# EAGLE design Own_21700_Board_Plus.pro_v1.1_Final_AR (EAGLE 9.6.2)
COMPANY: ADAFRUIT INDUSTRIES; DRAWN: KTOWN; REV: A; YEAR: 2019
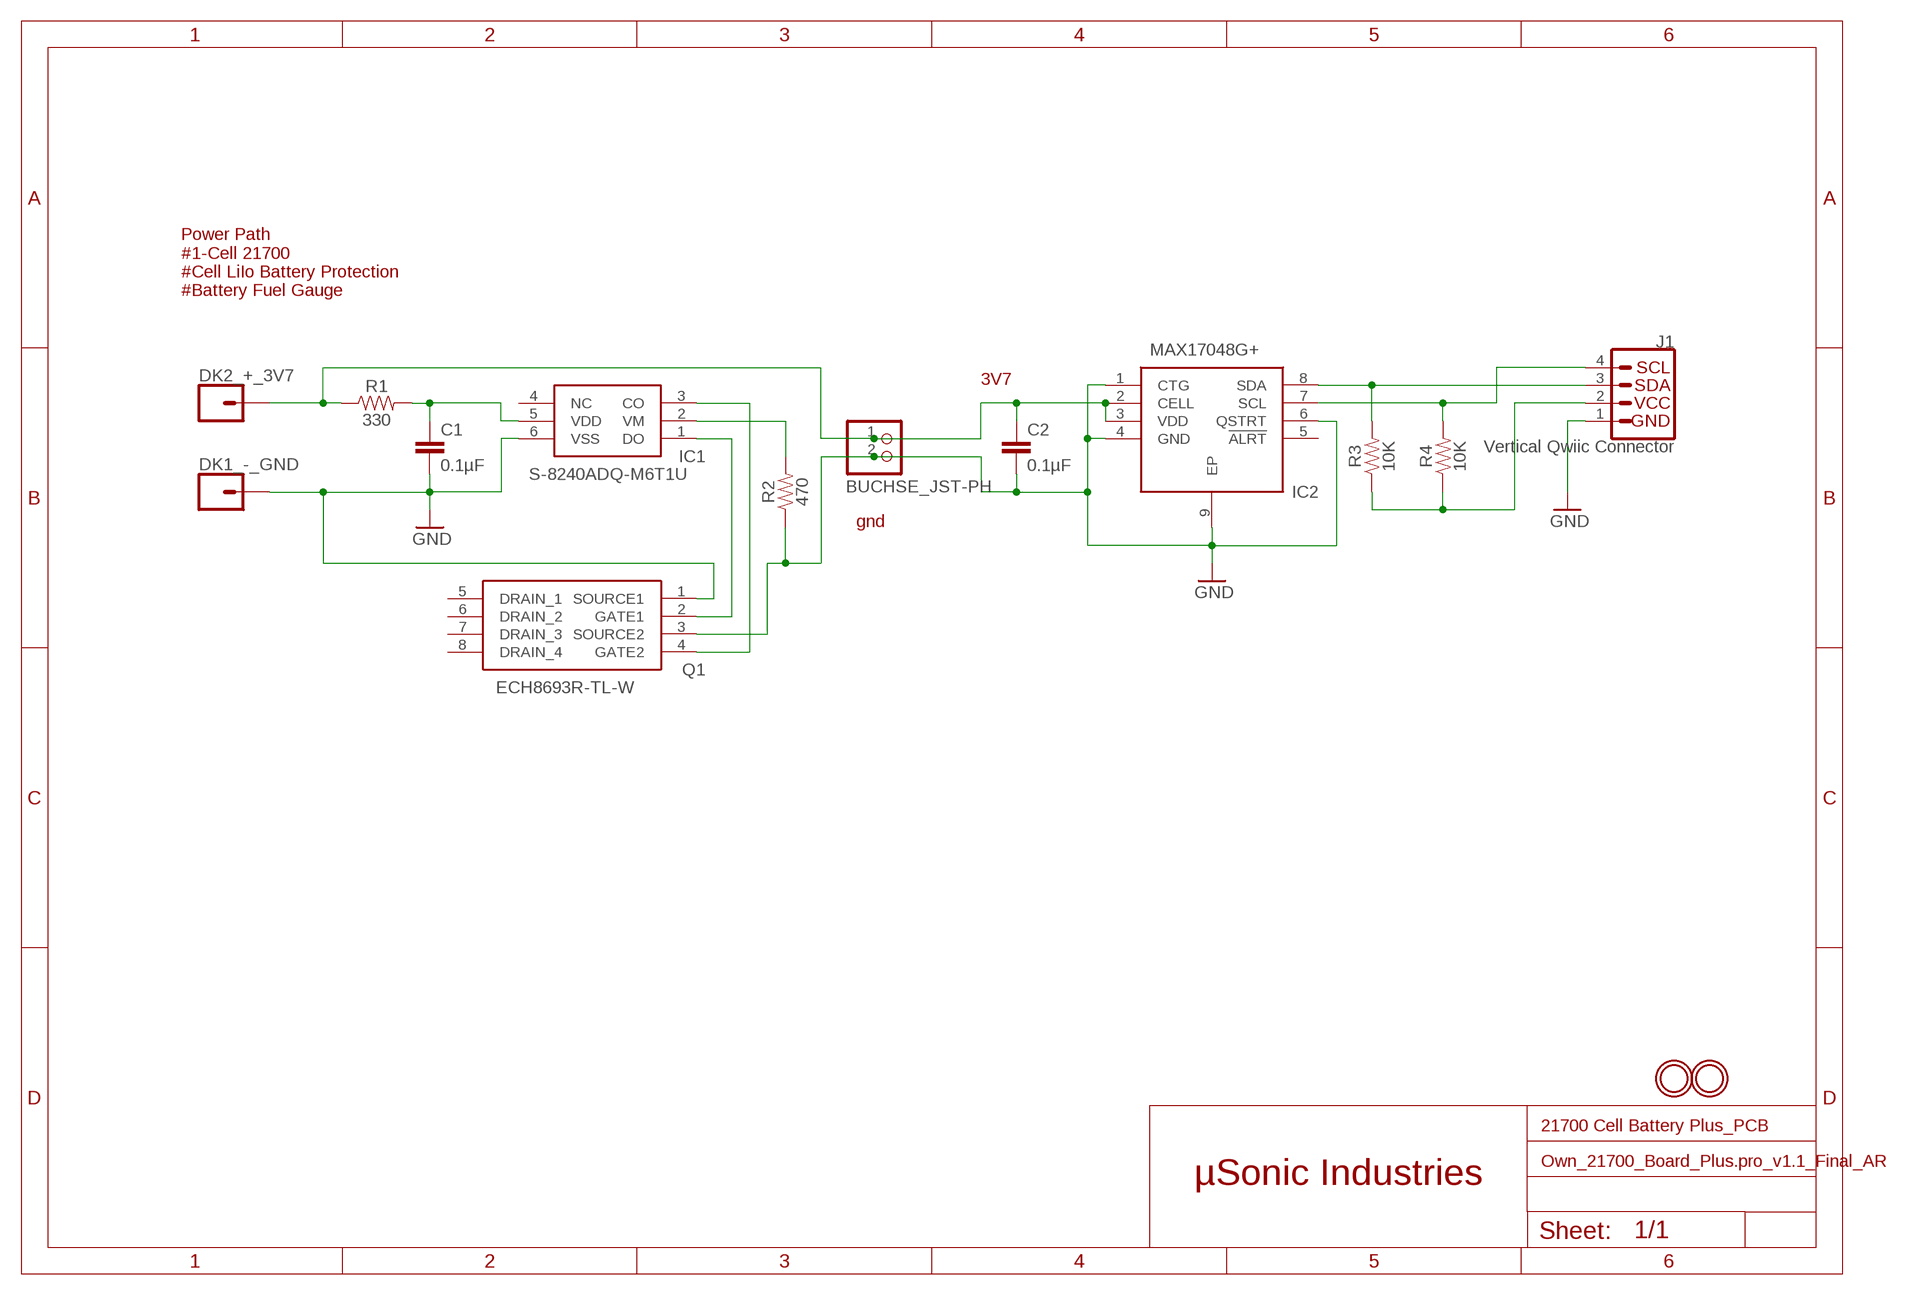
[diagram p0: schematic, sheet 1]

## Parts
BUCHSE_JST-PH  JST_2PINOWN  [JST-PH-2-THMOWN]
C1  0.1µF  0.33UF/330NF-0805-50V-10%  [0805]
C2  0.1µF  0.33UF/330NF-0805-50V-10%  [0805]
DK1_-_GND  CONN_01PTH_2MM  [1X01_2MM]
DK2_+_3V7  CONN_01PTH_2MM  [1X01_2MM]
IC1  S-8240ADQ-M6T1U  [SOT95P275X135-6N]
IC2  MAX17048G+  [SON50P200X200X80-9N]
J1  Vertical Qwiic Connector  QWIIC_CONNECTOROWN  [JST04_1MM_VERT]
Q1  ECH8693R-TL-W  [SOTFL65P280X95-8N]
R1  330  RESISTOR0805  [0805]
R2  470  RESISTOR0805  [0805]
R3  10K  RESISTOR0805  [0805]
R4  10K  RESISTOR0805  [0805]
U$3  MOUNTINGHOLE2.5  [MOUNTINGHOLE_2.5_PLATED]
U$5  MOUNTINGHOLE2.5  [MOUNTINGHOLE_2.5_PLATED]

## Nets
3V3: J1.2 R3.1 R4.1
3V7: BUCHSE_JST-PH.1 C2.1 DK2_+_3V7.1 IC2.2(CELL) IC2.3(VDD) R1.1
GATE1: IC1.1(DO) Q1.2(GATE1)
GATE2: IC1.3(CO) Q1.4(GATE2)
GND: BUCHSE_JST-PH.2 C1.2 C2.2 DK1_-_GND.1 IC1.6(VSS) IC2.1(CTG) IC2.4(GND) IC2.6(QSTRT) IC2.9(EP) J1.1 Q1.1(SOURCE1) Q1.3(SOURCE2) R2.1
N$9: IC2.8(SDA) J1.3 R3.2
N$10: IC2.7(SCL) J1.4 R4.2
VDD: C1.1 IC1.5(VDD) R1.2
VM: IC1.2(VM) R2.2
Unconnected: IC1.4(NC) IC2.5(!ALRT) Q1.5(DRAIN_1) Q1.6(DRAIN_2) Q1.7(DRAIN_3) Q1.8(DRAIN_4)

## Notes on the sheet
- Power Path
  #1-Cell 21700
  #Cell LiIo Battery Protection
  #Battery Fuel Gauge
- 3V7
- gnd
- 21700 Cell Battery Plus_PCB
- µSonic Industries

## Library data of the parts
BUCHSE_JST-PH = adafruit2:JST_2PIN: JST 2-Pin Connectors of various flavors SMT-RA (S2B-PH-SM4) 4UConnector #17311 SMT (B2B-PH-SM4) THM-RA (S2B-PH) THM (B2B-PH)
C1 C2 = SparkFun-Capacitors:0.33UF/330NF: 0.33µF/330nF ceramic capacitors A capacitor is a passive two-terminal electrical component used to store electrical energy temporarily in an electric field.; PROD_ID: CAP-08469; VALUE: 0.33µF
DK1_-_GND DK2_+_3V7 = SparkFun-Connectors:CONN_01: Single connection point. Often used as Generic Header-pin footprint for 0.1 inch spaced/style header connections On any of the 0.1 inch spaced packages, you can populate with these: Break Away Headers - Straight <https://www.sparkfun.com/products/116> (PRT-00116) Break Away Male Headers - Right Angle <https://www.sparkfun.com/products/553> (PRT-00553) Female Headers <https://www.sparkfun.com/products/115> (PRT-00115) Break Away Headers - Machine Pin <https://www.sparkfun.com/products/117> (PRT-00117) Break Away Female Headers - Swiss Machine Pin <https://www.sparkfun.com/products/743> (PRT-00743) This device is also useful as a general connection point to wire up your design to another part of your project. Our various solder wires solder well into these plated through hole pads. Hook-Up Wire - Assortment (Stranded, 22 AWG) <https://www.sparkfun.com/products/11375> (PRT-11375) Hook-Up Wire - Assortment (Solid Core, 22 AWG) <https://www.sparkfun.com/products/11367> (PRT-11367) View the entire wire category on our website here <https://www.sparkfun.com/categories/141> Special notes: SMTSO-256-ET is a "flush mount" nut for a 4-40 screw. We mostly use this on specialty testbeds; it is a nice way to connect hardware to your PCB at an adjustable hieght. Also note, the SNAP packages are for using a snappable style connector. We sell a baggie of snaps and they are also used on two LilyPad designs: Snap Assortment - 30 pack (male and female) <https://www.sparkfun.com/products/11347> (DEV-11347) LilyPad Arduino SimpleSnap <https://www.sparkfun.com/products/10941> (DEV-10941) LilyPad SimpleSnap Protoboard <https://www.sparkfun.com/products/10940> (DEV-10940)
IC1 = S-8240ADQ-M6T1U:S-8240ADQ-M6T1U: Battery Management BATTERY PROTECTION IC FOR 1 CELL PACK Source: Datasheet <https://componentsearchengine.com/Datasheets/1/S-8240ADQ-M6T1U.pdf>; DESCRIPTION: Battery Management BATTERY PROTECTION IC FOR 1 CELL PACK; HEIGHT: 1.35mm; MANUFACTURER_NAME: ABLIC Inc.; MANUFACTURER_PART_NUMBER: S-8240ADQ-M6T1U; MOUSER_PART_NUMBER: 628-S-8240ADQ-M6T1U; MOUSER_PRICE-STOCK: https://www.mouser.co.uk/ProductDetail/ABLIC/S-8240ADQ-M6T1U?qs=B6kkDfuK7%2FDVaX7hph1YCg%3D%3D
IC2 = MAX17048G+:MAX17048G+: 3uA 1-Cell/2-Cell Fuel Gauge with ModelGauge, TDFN-8 Source: Datasheet <https://datasheets.maximintegrated.com/en/ds/MAX17048-MAX17049.pdf>; DESCRIPTION: 3uA 1-Cell/2-Cell Fuel Gauge with ModelGauge, TDFN-8; HEIGHT: 0.8mm; MANUFACTURER_NAME: Maxim Integrated; MANUFACTURER_PART_NUMBER: MAX17048G+; MOUSER_PART_NUMBER: 700-MAX17048G+; MOUSER_PRICE-STOCK: https://www.mouser.co.uk/ProductDetail/Maxim-Integrated/MAX17048G%2b?qs=D7PJwyCwLArjnts0jPerYw%3D%3D
J1 = SparkFun-Connectors2:QWIIC_CONNECTOR: SparkFun I2C Standard Qwiic Connector An SMD 1mm pitch JST connector makes it easy and quick (get it? Qwiic?) to connect I2C devices to each other. The Qwiic system <http://www.sparkfun.com/qwiic> enables fast and solderless connection between popular platforms and various sensors and actuators. We carry 200mm <https://www.sparkfun.com/products/14204>, 100mm <https://www.sparkfun.com/products/14205>, 50mm <https://www.sparkfun.com/products/14206>, and breadboard friendly <https://www.sparkfun.com/products/14207> Qwiic cables. We also offer 10 pcs strips <https://www.sparkfun.com/products/14323> the SMD connectors.; PROD_ID: CONN-14483
Q1 = ECH8693R-TL-W:ECH8693R-TL-W: ON SEMICONDUCTOR - ECH8693R-TL-W - MOSFET, DUAL N-CH, 24V, 14A, SOT-28FL Source: Datasheet <http://www.onsemi.com/pub/Collateral/ECH8693R-D.PDF>; ARROW_PART_NUMBER: ECH8693R-TL-W; ARROW_PRICE-STOCK: https://www.arrow.com/en/products/ech8693r-tl-w/on-semiconductor; DESCRIPTION: ON SEMICONDUCTOR - ECH8693R-TL-W - MOSFET, DUAL N-CH, 24V, 14A, SOT-28FL; HEIGHT: 0.95mm; MANUFACTURER_NAME: onsemi; MANUFACTURER_PART_NUMBER: ECH8693R-TL-W; MOUSER_PART_NUMBER: 863-ECH8693R-TL-W; MOUSER_PRICE-STOCK: https://www.mouser.co.uk/ProductDetail/onsemi/ECH8693R-TL-W?qs=Tr3lMbyRyKkLUc9md0qy2g%3D%3D
R1-R4 = SparkFun-Resistors:RESISTOR: Generic Resistor Package
U$3 U$5 = microbuilder:MOUNTINGHOLE: Mounting Hole For #2 screws (0.086"/2.18mm width, 0.094"/2.4mm hole) use 2.5mm; BOM: EXCLUDE

## Net classes
0 default: width 0.25 mm

## Board
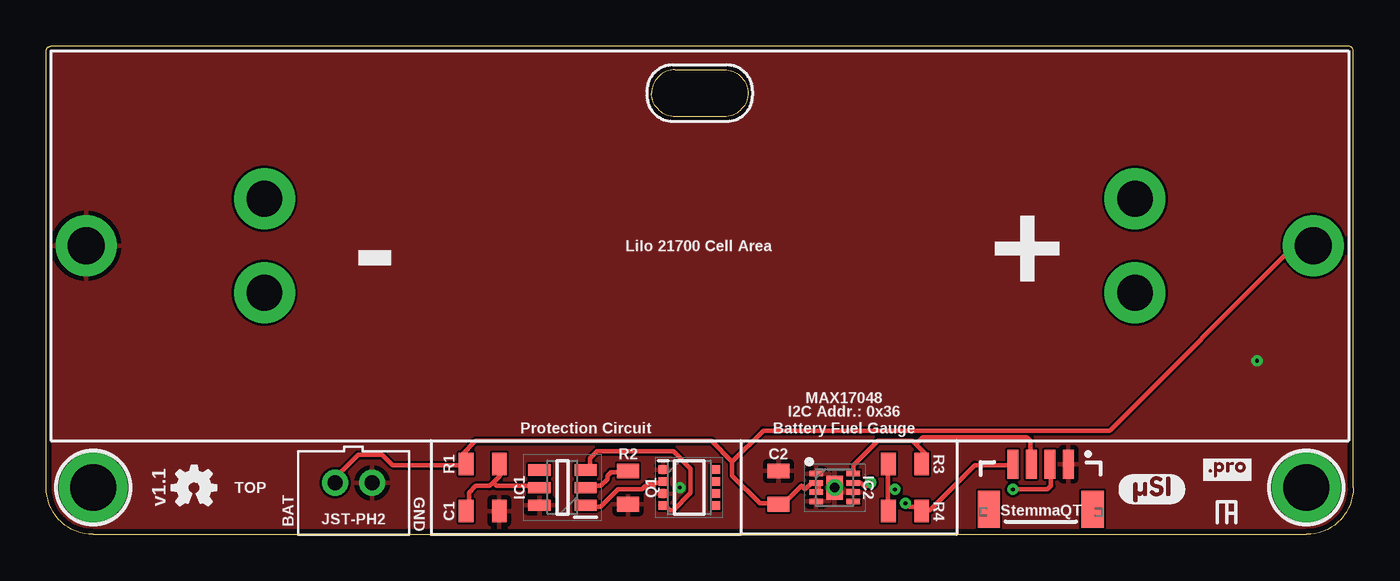
[diagram p1: board, top side]
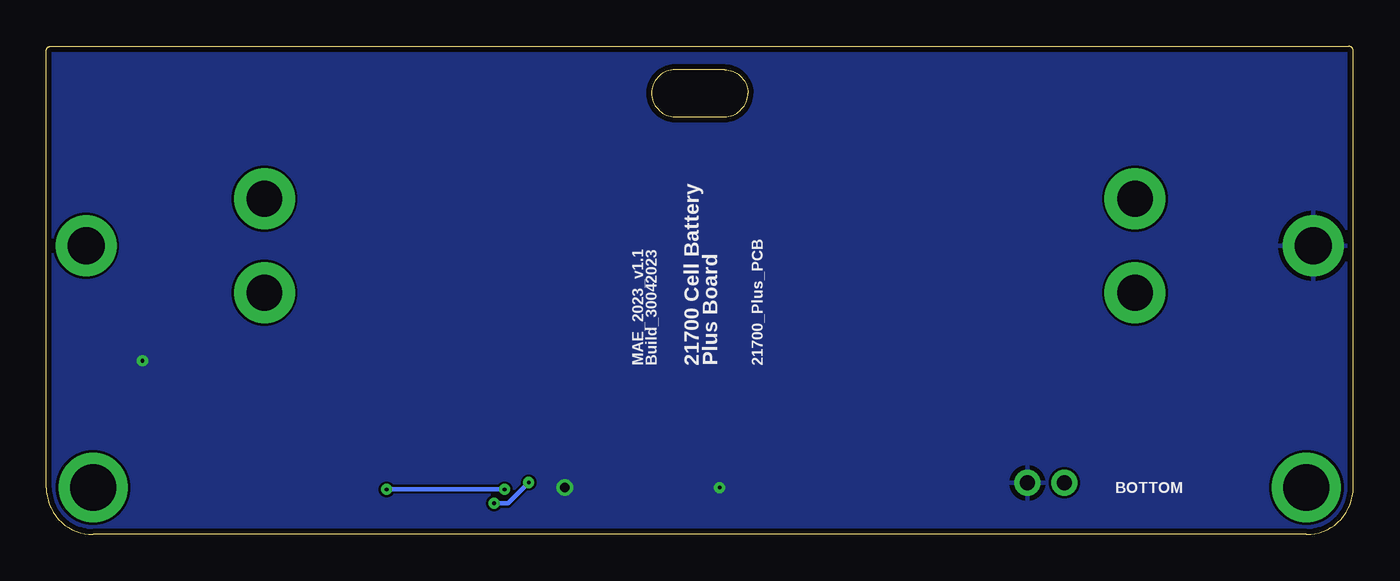
[diagram p2: board, bottom side, seen from below]

Size 70.74 x 26.42 mm. Coordinates in mm from the lower left corner, seen from the top.
Outline: 0,2.54 0,26.16 arc-90 0.25,26.42 70.48,26.42 arc-90 70.74,26.16 70.74,2.54 arc-90 68.2,0 2.54,0 arc-90 0,2.54
Outline: 34.04,25.15 36.7,25.15 arc-90 37.97,23.88 arc-90 36.7,22.61 34.04,22.61 arc-90 32.77,23.88 arc-90 34.04,25.15
Copper layers (1*16): Top 0.035mm / dielectric 1.5mm / Bottom 0.035mm
Design rules "aisler_2_layer_complex": minimum track width 0.125mm, minimum drill 0.2mm, track to track 0.125mm, track to pad 0.125mm, pad to pad 0.125mm, via to via 0.125mm, smd to smd 0.125mm, copper to edge 0.3mm, drill to drill 0.25mm, minimum pad ring 0.2mm, minimum via ring 0.2mm, stop-mask expansion 0mil, vias tented up to drill 0mil, thermal gap 10mil

### Footprints (pad centres in the part's own frame; a part is rotated, then mirrored left to right if it is on the bottom)
JST-PH-2-THMOWN = drill 0.8 pad 1.422: 1 1,0; 2 -1,0
0805 = smd 0.8 x 1.2: 1 -0.9,0; 2 0.9,0
1X01_2MM = drill 2 pad 3.302: 1 0,0
SOT95P275X135-6N = smd 1.2 x 0.6: 1 -1.25,0.95; 2 -1.25,0; 3 -1.25,-0.95; 4 1.25,-0.95; 5 1.25,0; 6 1.25,0.95
SON50P200X200X80-9N = smd 0.75 x 0.3: 1 -1,0.75; 2 -1,0.25; 3 -1,-0.25; 4 -1,-0.75; 5 1,-0.75; 6 1,-0.25; 7 1,0.25; 8 1,0.75 | smd 0.9 x 1.3: 9 0,0
JST04_1MM_VERT = smd 0.6 x 1.55: 1 -1.478,0.775; 2 -0.478,0.775; 3 0.522,0.775; 4 1.522,0.775 | smd 1.2 x 2: NC1 -2.778,3.2; NC2 2.822,3.2
SOTFL65P280X95-8N = smd 0.515 x 0.45: 1 -1.408,0.975; 2 -1.408,0.325; 3 -1.408,-0.325; 4 -1.408,-0.975; 5 1.408,-0.975; 6 1.408,-0.325; 7 1.408,0.325; 8 1.408,0.975
MOUNTINGHOLE_2.5_PLATED = drill 2.5 pad 3.2: P$1 0,0

### Placement (x,y rotation side)
BUCHSE_JST-PH  16.64,2.79 180 top
C1  23.62,1.27 0 top
C2  39.62,2.54 90 top
DK1_-_GND  2.16,15.62 0 top
DK2_+_3V7  68.58,15.62 0 top
IC1  27.94,2.54 180 top
IC2  42.67,2.54 0 top
J1  53.85,4.57 180 top
Q1  34.8,2.54 0 top
R1  23.62,3.81 0 top
R2  31.5,2.54 90 top
R3  46.48,3.81 0 top
R4  46.48,1.27 0 top
U$3  2.54,2.54 0 top
U$5  68.2,2.54 0 top
U$6  [OSHW-LOGO-MINI]  8,2.54 0 top
U$7  [µSI2]  58.04,1.65 0 top
U$8  [PRO2]  62.61,2.92 0 top

### Tracks (layer width: path | path; a pad name or v marks a point on that pad's centre or on a via)
3V3  (via drill 0.2)
  Top 0.25: 45.56,2.44 45.56,3.75 R3.1 | 45.56,2.44 45.56,1.31 R4.1 | v52.31,2.44 54.19,2.44 54.38,2.62 54.38,3.75 J1.2 | 45.56,2.44 v45.94,2.44
  Bottom 0.25: v45.94,2.44 v52.31,2.44
3V7
  Top 0.25: IC2.3 41.81,2.44 41.81,2.81 IC2.2 41.62,2.81 41.44,2.81 41.06,2.44 40.88,2.62 39.75,1.5 C2.1 39.56,1.69 38.62,1.69 37.12,3.19 37.12,3.94 | 22.5,3.75 18.75,3.75 18.19,4.31 16.88,4.31 15.75,3.19 15.75,2.81 BUCHSE_JST-PH.1 | 22.5,3.75 22.69,3.75 R1.1 22.5,3.75 | 37.12,3.94 36,5.06 23.25,5.06 22.5,4.31 22.5,3.75 | 37.12,3.94 38.81,5.62 57.56,5.62 67.5,15.56 68.44,15.56 DK2_+_3V7.1
GATE1
  Top 0.25: Q1.2 33.38,2.81 33,2.81 32.81,2.62 32.62,2.81 32.25,2.44 30.94,2.44 30,1.5 29.25,1.5 IC1.1
GATE2
  Top 0.25: Q1.4 33.56,1.5 33.75,1.31 33.94,1.31 34.88,2.25 34.88,3.56 33.94,4.5 29.81,4.5 29.44,4.12 29.44,3.56 29.25,3.38 IC1.3
GND  (via drill 0.2, 0.5 pad 0.8)
  other vias: 42.67,2.54 65.53,9.4 34.29,2.54
  pour Top: 0,26.42 70.74,26.42 70.74,0 0,0
  pour Bottom: 0,0 0,26.42 70.74,26.42 70.74,0
N$1  (via drill 1.93 pad 3.3)
  other vias: 11.81,18.16
N$3  (via drill 1.93 pad 3.3)
  other vias: 11.81,13.08
N$4  (via drill 1.93 pad 3.3)
  other vias: 58.93,13.08
N$5  (via drill 1.93 pad 3.3)
  other vias: 58.93,18.16
N$9
  Top 0.25: 47.06,4.88 47.62,4.31 47.62,4.12 47.44,3.94 R3.2 | 47.06,4.88 46.88,5.06 45,5.06 43.69,3.75 43.69,3.38 IC2.8 | 47.06,4.88 47.44,5.25 53.06,5.25 53.25,5.06 53.25,3.94 J1.3
N$10  (via drill 0.2)
  Top 0.25: v44.62,2.81 44.44,2.62 44.25,2.62 44.06,2.81 43.69,2.81 IC2.7 | v46.5,1.69 46.69,1.5 47.25,1.5 47.44,1.31 | 47.44,1.31 47.81,1.31 50.25,3.75 52.31,3.75 J1.4 | 47.44,1.31 R4.2
  Bottom 0.25: v44.62,2.81 45.75,1.69 v46.5,1.69
VDD
  Top 0.25: 24.19,2.81 24.56,3.19 24.56,3.75 R1.2 | 24.19,2.81 24,2.62 23.25,2.62 22.88,2.25 22.88,1.31 C1.1 | 24.19,2.81 24.38,2.62 26.62,2.62 IC1.5
VM
  Top 0.25: IC1.2 29.25,2.62 30,2.62 30.38,3 30.38,3.19 30.56,3.38 31.31,3.38 R2.2

### Text on the board
tPlace: - | LiIo 21700 Cell Area | + | MAX17048 / I2C Addr.: 0x36 | Protection Circuit | Battery Fuel Gauge | R1 | R2 | C2 | R3 | TOP | IC1 | Q1 | IC2 | v1.1 | BAT | GND | JST-PH2 | C1 | R4 | StemmaQT
bPlace: 21700_Plus_PCB | 21700 Cell Battery / Plus Board | MAE_2023_v1.1 / Build_30042023 | BOTTOM